# Altium schematic sheet RS232.SchDoc: RS232
size OrCAD A; DocumentNumber: LM-003; Revision: 3.0; SheetNumber: 4; SheetTotal: 5
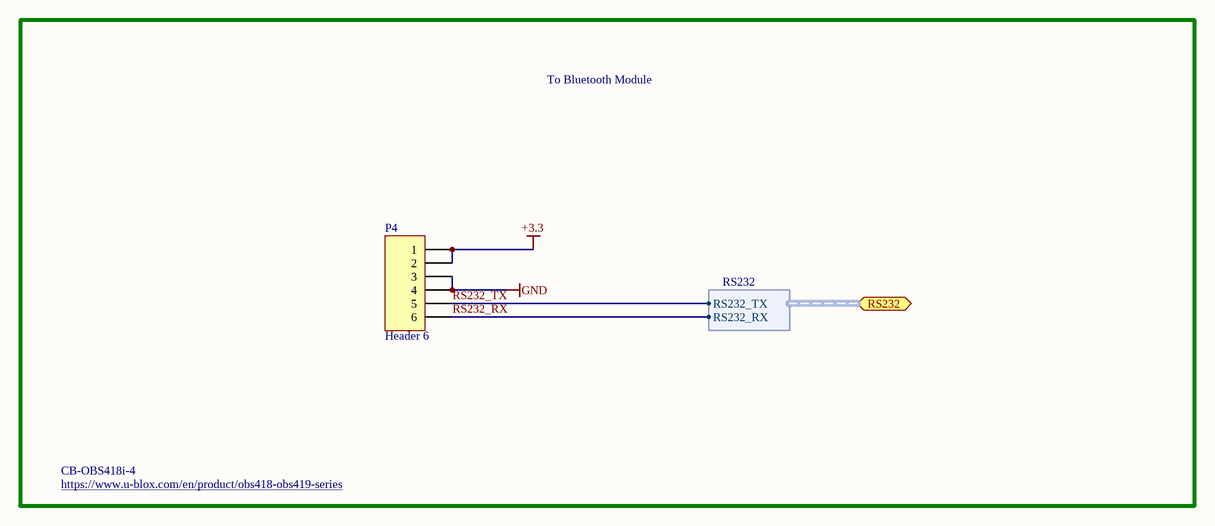
[diagram p0: RS232.SchDoc]

## Parts
P4  Header 6  [HDR1X6]

## Ports
RS232 (harness RS232)

## Harnesses
RS232: RS232_RX, RS232_TX

## Nets
+3.3: P4.1 P4.2
GND: P4.3 P4.4
RS232_RX: P4.6 ; port RS232.RS232_RX
RS232_TX: P4.5 ; port RS232.RS232_TX

## Notes on the sheet
- To Bluetooth Module
- CB-OBS418i-4
- https://www.u-blox.com/en/product/obs418-obs419-series
- Title
- Size:
- Date:
- Orcad A
- Number:
- Time:
- Revision:
- Sheet
- of
- ZLS Corporation
- 7801 North Lamar Blvd
- Suite E-184
- Austin, TX  78752
- Phone: (512) 453-0288
- File:

## Library data of the parts
P4 = Header 6: Header, 6-Pin; LatestRevisionDate: 17-Jul-2002; LatestRevisionNote: Re-released for DXP Platform.; Publisher: Altium Limited